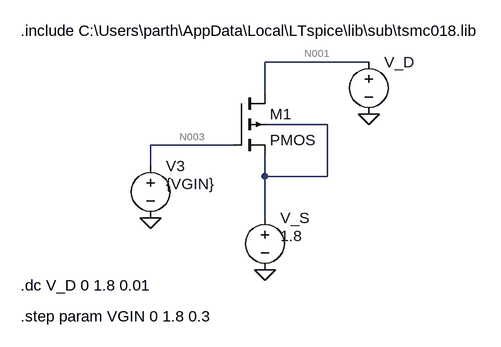
[diagram p0: schematic Part-A - b).asc]
Part-A - b).asc, the LTspice schematic file:
Version 4
SHEET 1 880 680
WIRE 96 80 -64 80
WIRE -64 128 -64 80
WIRE 32 176 -64 176
WIRE -112 208 -240 208
WIRE -240 240 -240 208
WIRE -64 256 -64 224
WIRE 32 256 32 176
WIRE 32 256 -64 256
WIRE -64 320 -64 256
FLAG -240 320 0
FLAG -64 400 0
FLAG 96 160 0
SYMBOL voltage -240 224 R0
WINDOW 3 24 44 Left 2
WINDOW 123 0 0 Left 0
WINDOW 39 0 0 Left 0
SYMATTR Value {VGIN}
SYMATTR InstName V3
SYMBOL pmos4 -112 128 R0
SYMATTR InstName M1
SYMATTR Value2 l=0.3204u w=17.8u
SYMBOL voltage -64 304 R0
WINDOW 123 0 0 Left 0
WINDOW 39 0 0 Left 0
WINDOW 3 24 44 Left 2
SYMATTR Value 1.8
SYMATTR InstName V_S
SYMBOL voltage 96 64 R0
WINDOW 123 0 0 Left 0
WINDOW 39 0 0 Left 0
SYMATTR InstName V_D
SYMATTR Value ""
TEXT -440 32 Left 2 !.include C:\\Users\\parth\\AppData\\Local\\LTspice\\lib\\sub\\tsmc018.lib
TEXT -440 424 Left 2 !.dc V_D 0 1.8 0.01
TEXT -440 472 Left 2 !.step param VGIN 0 1.8 0.3

The netlist it stands for:
* Part-A - b).asc
V3 N003 0 {VGIN}
M1 N001 N003 N002 N002 PMOS l=0.3204u w=17.8u
V_S N002 0 1.8
V_D N001 0
.model NMOS NMOS
.model PMOS PMOS
.lib standard.mos
.include C:\Users\parth\AppData\Local\LTspice\lib\sub\tsmc018.lib
.dc V_D 0 1.8 0.01
.step param VGIN 0 1.8 0.3
.backanno
.end

* Results of the author's LTspice run, read from the files saved beside the schematic
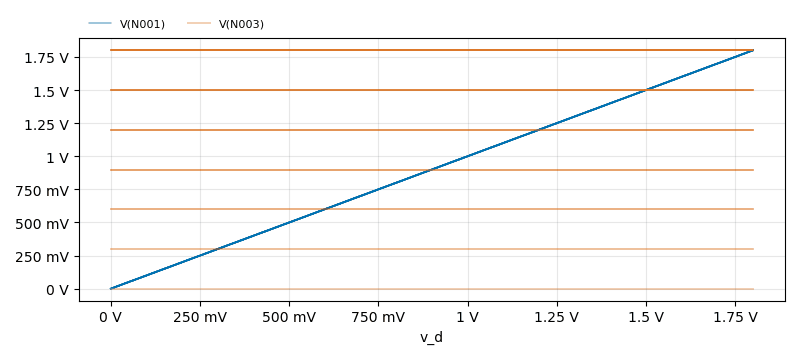
[diagram p1: DC transfer characteristic of Part-A - b).asc, plotted from the saved traces]
* DC transfer characteristic, 7 runs:
*   V(N001) [vgin=0]: 0 V at v_d=0 V, 1.8 V at v_d=1.8 V, min 0 V, max 1.8 V
*   V(N001) [vgin=0.3]: 0 V at v_d=0 V, 1.8 V at v_d=1.8 V, min 0 V, max 1.8 V
*   V(N001) [vgin=0.6]: 0 V at v_d=0 V, 1.8 V at v_d=1.8 V, min 0 V, max 1.8 V
*   V(N001) [vgin=0.9]: 0 V at v_d=0 V, 1.8 V at v_d=1.8 V, min 0 V, max 1.8 V
*   V(N001) [vgin=1.2]: 0 V at v_d=0 V, 1.8 V at v_d=1.8 V, min 0 V, max 1.8 V
*   V(N001) [vgin=1.5]: 0 V at v_d=0 V, 1.8 V at v_d=1.8 V, min 0 V, max 1.8 V
*   V(N001) [vgin=1.8]: 0 V at v_d=0 V, 1.8 V at v_d=1.8 V, min 0 V, max 1.8 V
*   V(N003) [vgin=0]: 0 V at v_d=0 V, 0 V at v_d=1.8 V, min 0 V, max 0 V
*   V(N003) [vgin=0.3]: 300 mV at v_d=0 V, 300 mV at v_d=1.8 V, min 300 mV, max 300 mV
*   V(N003) [vgin=0.6]: 600 mV at v_d=0 V, 600 mV at v_d=1.8 V, min 600 mV, max 600 mV
*   V(N003) [vgin=0.9]: 900 mV at v_d=0 V, 900 mV at v_d=1.8 V, min 900 mV, max 900 mV
*   V(N003) [vgin=1.2]: 1.2 V at v_d=0 V, 1.2 V at v_d=1.8 V, min 1.2 V, max 1.2 V
*   V(N003) [vgin=1.5]: 1.5 V at v_d=0 V, 1.5 V at v_d=1.8 V, min 1.5 V, max 1.5 V
*   V(N003) [vgin=1.8]: 1.8 V at v_d=0 V, 1.8 V at v_d=1.8 V, min 1.8 V, max 1.8 V